# Altium schematic sheet [09] - FTDI.SchDoc: USB
size A4; Organization: Tor Brodtkorb; Address1: Frode Rinnans veg 193; Address2: 7050 Trondheim; DocumentNumber: 6598; Revision: 1.0; SheetNumber: 1; SheetTotal: 1
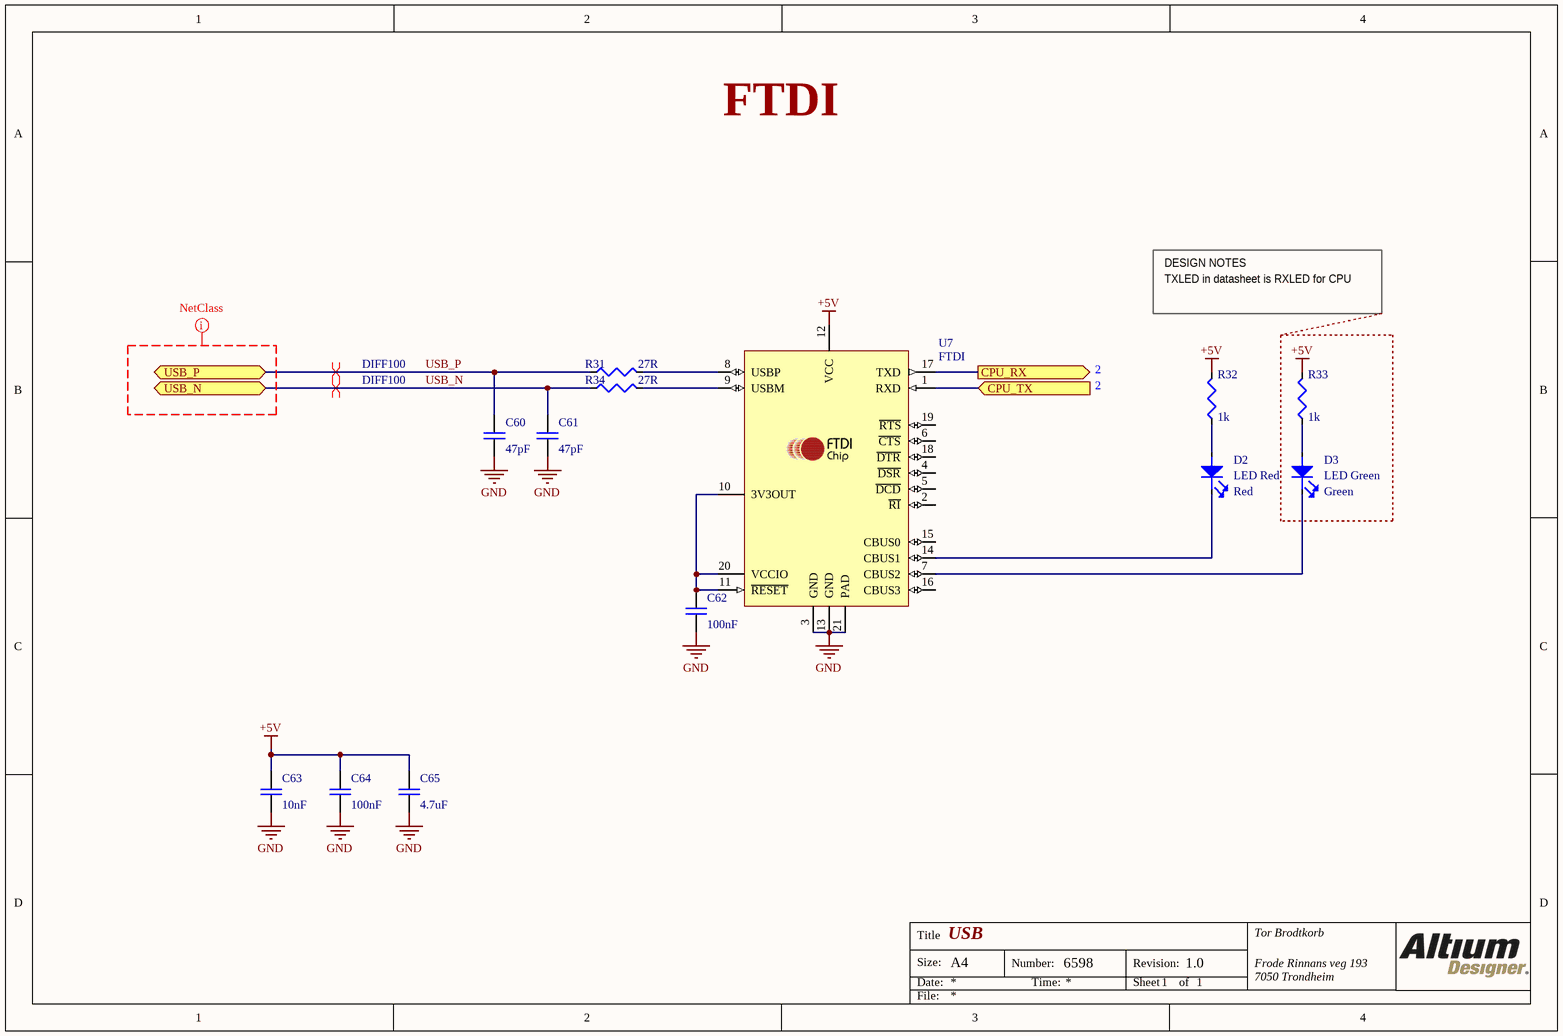
[diagram p0: [09] - FTDI.SchDoc]

## Parts
C60  value 47pF  [C0603]  (hidden comment: 02016D104KAT2A)
C61  value 47pF  [C0603]  (hidden comment: 02016D104KAT2A)
C62  value 100nF  [C0603]  (hidden comment: 02016D104KAT2A)
C63  value 10nF  [C0603]  (hidden comment: 02016D104KAT2A)
C64  value 100nF  [C0603]  (hidden comment: 02016D104KAT2A)
C65  value 4.7uF  [C0603]  (hidden comment: 02016D104KAT2A)
D2  LED Red  Color: Red  [L0603 RED]
D3  LED Green  Color: Green  [L0603 GREEN]
R31  value 27R  [R0603]  (hidden comment: CPF-A-0603B100KE1)
R32  value 1k  [R0603]  (hidden comment: CPF-A-0603B100KE1)
R33  value 1k  [R0603]  (hidden comment: CPF-A-0603B100KE1)
R34  value 27R  [R0603]  (hidden comment: CPF-A-0603B100KE1)
U7  FTDI  [FT231XQ-R]

## Ports
CPU_RX (out), CPU_TX (in), USB_N (bidir), USB_P (bidir)

## Nets
+5V: C63.2 C64.2 C65.2 R32.2 R33.2 U7.12(VCC)
GND: C60.1 C61.1 C62.1 C63.1 C64.1 C65.1 U7.3(GND) U7.13(GND) U7.21(PAD)
CPU_RX: U7.17(TXD) ; port CPU_RX
CPU_TX: U7.1(RXD) ; port CPU_TX
USB_N: C61.2 R34.1 ; port USB_N
USB_P: C60.2 R31.1 ; port USB_P
NetC62_2: C62.2 U7.10(3V3OUT) U7.11(~{RESET}) U7.20(VCCIO)
NetD2_1: D2.1 R32.1
NetD2_2: D2.2 U7.14(CBUS1)
NetD3_1: D3.1 R33.1
NetD3_2: D3.2 U7.7(CBUS2)
NetR31_2: R31.2 U7.8(USBP)
NetR34_2: R34.2 U7.9(USBM)

Not connected (* = marked no-connect by the designer): U7 2(~{RI}) 4(~{DSR}) 5(~{DCD}) 6(~{CTS}) 15(CBUS0) 16(CBUS3) 18(~{DTR}) 19(~{RTS})

## Layout directives
differential pair; differential pair class DIFF100: USB_N, USB_P
mark named NetClass: (no net found under the mark)

## Notes on the sheet
- FTDI
- DESIGN NOTES
- TXLED in datasheet is RXLED for CPU
- 2
- Title
- Size:
- Date:
- A4
- Number:
- Time:
- Revision:
- Sheet
- of
- File:

## Library data of the parts
C60-C65 = 02016D104KAT2A: C0603
D2 = HSMG-C190: LED 0603 Red
D3 = HSMG-C196: LED 0603 Green
R31-R34 = CPF-A-0603B100KE1: R0603
U7 = FT231XQ-R: UART to USB converter